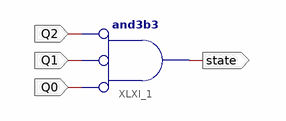
[diagram p0: schematic sheet 1]
// Xilinx ISE schematic StateClear.sch (spartan3e) as structural Verilog: 1 symbols, 4 ports
module StateClear (
  input  Q2,
  input  Q1,
  input  Q0,
  output state
);

  and XLXI_1 (state, ~Q0, ~Q1, ~Q2);  // and3b3
endmodule
